# EAGLE design HYPNOS_BOARD_SHIELD_V1 (EAGLE 8.1.1)
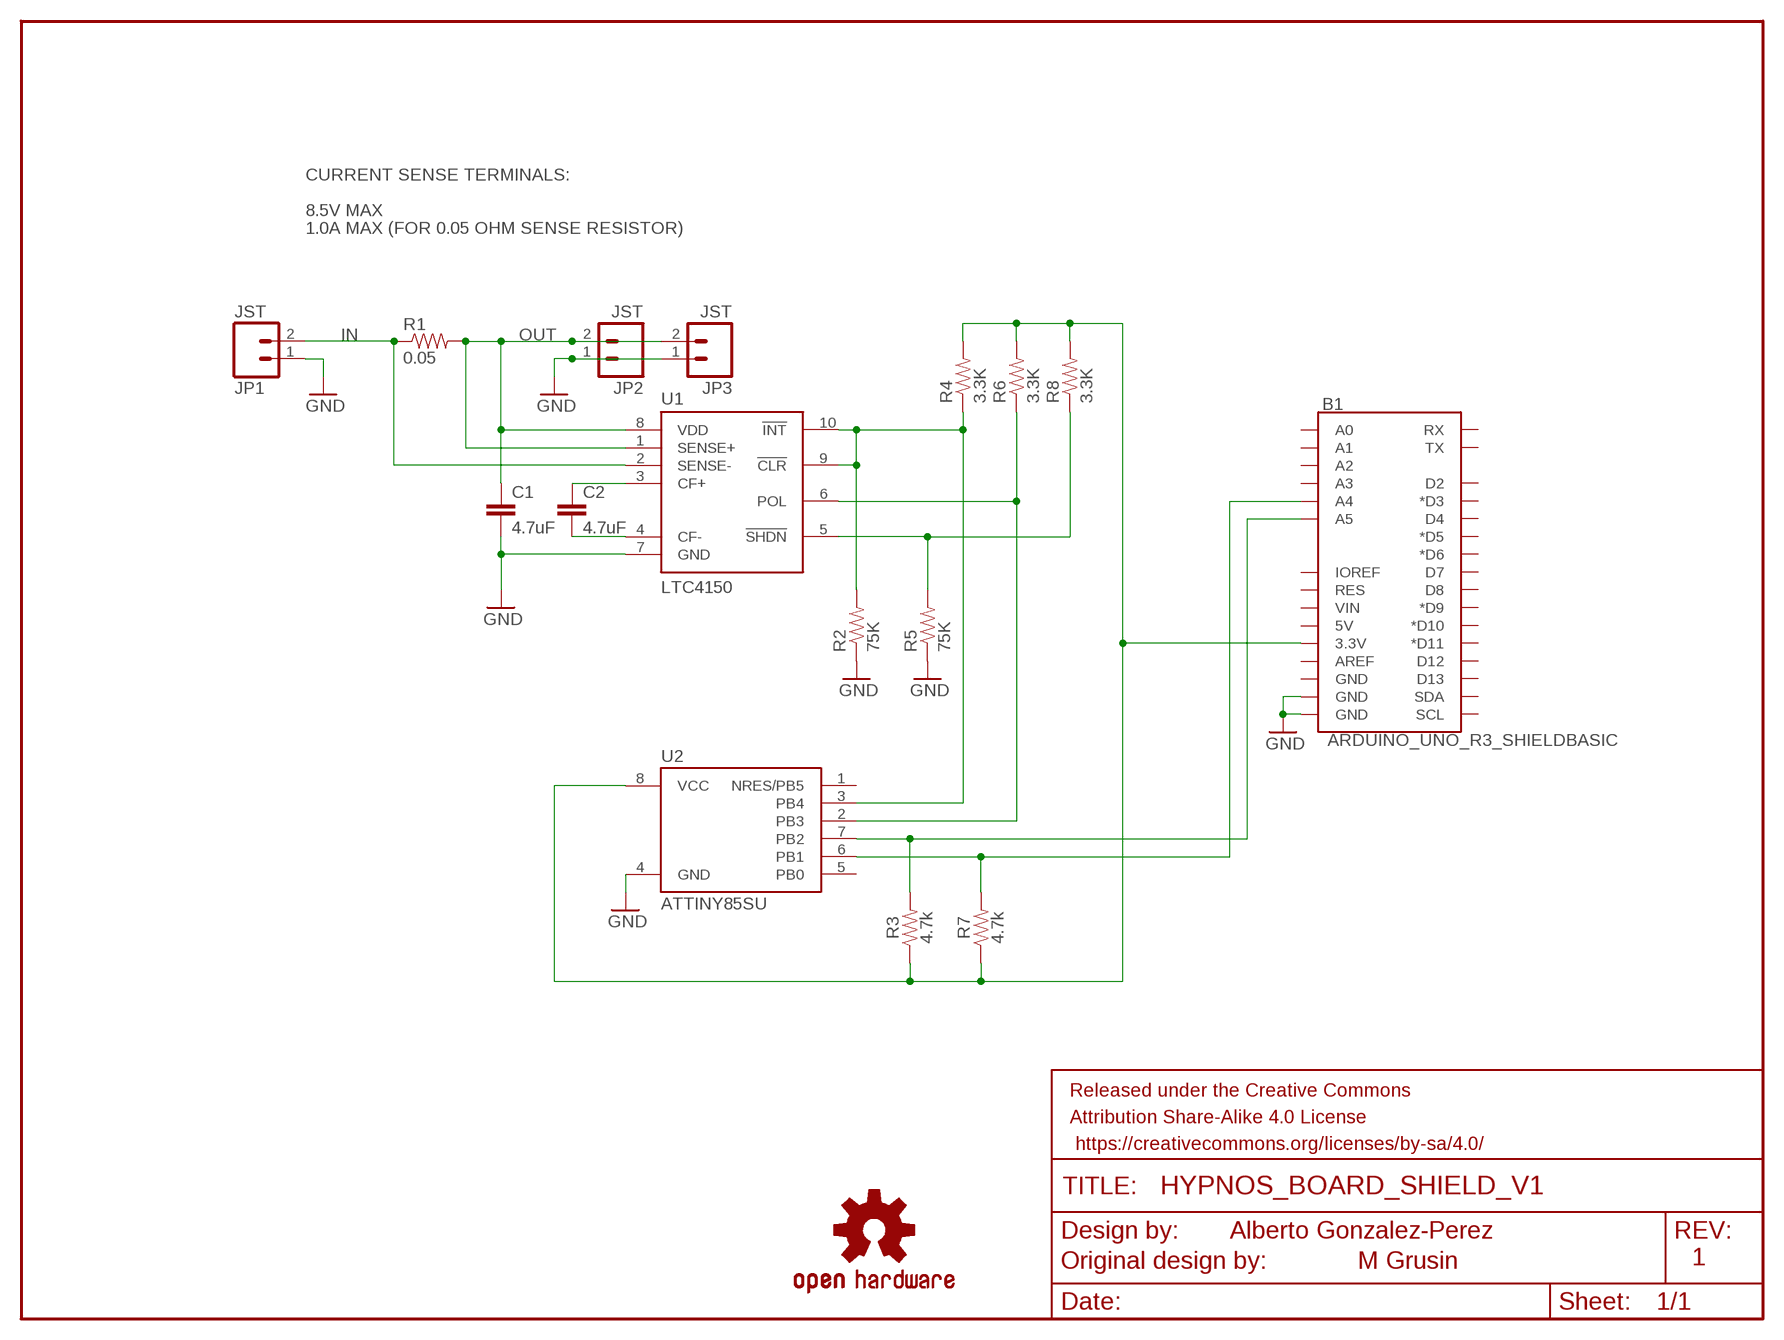
[diagram p0: schematic, sheet 1]

## Parts
B1  ARDUINO_UNO_R3_SHIELDBASIC  [UNO_R3_SHIELD]
C1  4.7uF  CAP0603-CAP  [0603-CAP]
C2  4.7uF  CAP0603-CAP  [0603-CAP]
FRAME1  FRAME-LETTER  [CREATIVE_COMMONS]
JP1  JST  M02-JST-2MM-SMT  [JST-2-SMD]
JP2  JST  M02-JST-2MM-SMT  [JST-2-SMD]
JP3  JST  M02-JST-2MM-SMT  [JST-2-SMD]
LOGO1  OSHW-LOGOS  [OSHW-LOGO-S]
R1  0.05  RESISTOR1206  [1206]
R2  75K  RESISTOR0603-RES  [0603-RES]
R3  4.7k  4.7KOHM-0603-1/10W-1%  [0603]
R4  3.3K  RESISTOR0603-RES  [0603-RES]
R5  75K  RESISTOR0603-RES  [0603-RES]
R6  3.3K  RESISTOR0603-RES  [0603-RES]
R7  4.7k  4.7KOHM-0603-1/10W-1%  [0603]
R8  3.3K  RESISTOR0603-RES  [0603-RES]
U1  LTC4150  [MSOP10]
U2  ATTINY85SU  [ATTINY85]

## Nets
3V3: B1.3.3V R3.1 R4.2 R6.2 R7.1 R8.2 U2.8(VCC)
!INT!: R2.2 R4.1 U1.9(!CLR!) U1.10(!INT!) U2.3(PB4)
!SHDN!: R5.2 R8.1 U1.5(!SHDN!)
GND: B1.GND@0(GND) B1.GND@1(GND) C1.2 JP1.1 JP2.1 JP3.1 R2.1 R5.1 U1.7(GND) U2.4(GND)
IN: JP1.2 R1.1 U1.2(SENSE-)
N$1: B1.A5 R3.2 U2.7(PB2)
N$3: C2.1 U1.3(CF+)
N$4: C2.2 U1.4(CF-)
OUT: C1.1 JP2.2 JP3.2 R1.2 U1.1(SENSE+) U1.8(VDD)
POL: R6.1 U1.6(POL) U2.2(PB3)
SDA: B1.A4 R7.2 U2.6(PB1)
Unconnected: B1.5V B1.A0 B1.A1 B1.A2 B1.A3 B1.AREF B1.D2 B1.D3(*D3) B1.D4 B1.D5(*D5) B1.D6(*D6) B1.D7 B1.D8 B1.D9(*D9) B1.D10(*D10) B1.D11(*D11) B1.D12 B1.D13 B1.GND@2(GND) B1.IOREF B1.RES B1.RX B1.SCL B1.SDA B1.TX B1.VIN U2.1(NRES/PB5) U2.5(PB0)

## Notes on the sheet
- CURRENT SENSE TERMINALS:
- 8.5V MAX
- 1.0A MAX (FOR 0.05 OHM SENSE RESISTOR)
- Alberto Gonzalez-Perez
- Original design by: | M Grusin | 1

## Library data of the parts
B1 = SparkFun-Boards:ARDUINO_UNO_R3_SHIELD: Arduino R3 Shield Footprint Shield form compatible with the Arduino Uno R3. SparkFun Products: MG2639 Cellular Shield <https://www.sparkfun.com/products/13120> MIDI Shield <https://www.sparkfun.com/products/12898> R3 Stackable Headers Kit <https://www.sparkfun.com/products/11417>
C1 C2 = SparkFun-Passives:CAP: Capacitor Standard 0603 ceramic capacitor, and 0.1" leaded capacitor.
FRAME1 = SparkFun-Aesthetics:FRAME-LETTER: Schematic Frame Standard 8.5x11 US Letter frame
JP1-JP3 = SparkFun-Connectors:M02: Standard 2-pin 0.1" header. Use with - straight break away headers ( PRT-00116) - right angle break away headers (PRT-00553) - swiss pins (PRT-00743) - machine pins (PRT-00117) - female headers (PRT-00115) Molex polarized connector foot print use with: PRT-08233 with associated crimp pins and housings. 2.54_SCREWTERM for use with PRT-10571. 3.5mm Screw Terminal footprints for PRT-08084 5mm Screw Terminal footprints for use with PRT-08433; PROD_ID: CONN-08352
LOGO1 = SparkFun-Aesthetics:OSHW-LOGO: Open Source Hardware Logo This logo indicates the piece of hardware it is found on incorporates a OSHW license and/or adheres to the definition of open source hardware found here: http://freedomdefined.org/OSHW
R1 R2 R4-R6 R8 = SparkFun-Passives:RESISTOR: Resistor Basic schematic elements and footprints for 0603, 1206, and PTH resistors.
R3 R7 = SparkFun-Resistors:4.7KOHM: 4.7kΩ resistor A resistor is a passive two-terminal electrical component that implements electrical resistance as a circuit element. Resistors act to reduce current flow, and, at the same time, act to lower voltage levels within circuits. - Wikipedia; PROD_ID: RES-07857
U1 = mike-temp:LTC4150
U2 = attiny85:ATTINY85: ATMEL ATtiny 85

## Board
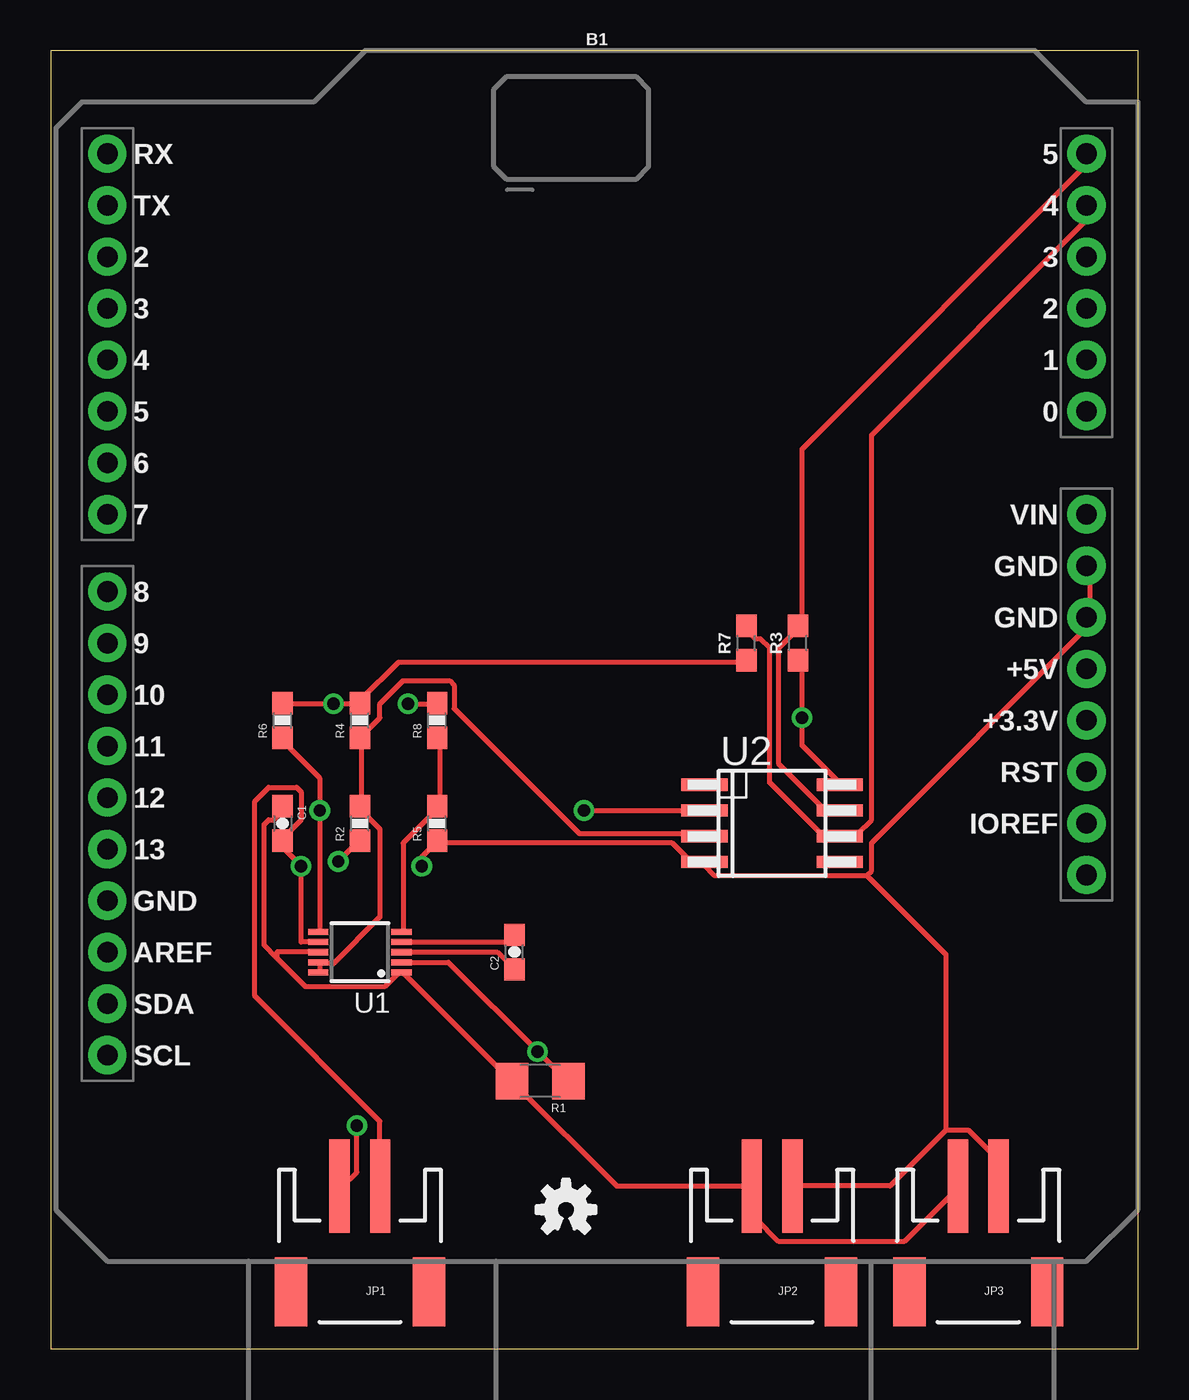
[diagram p1: board, top side]
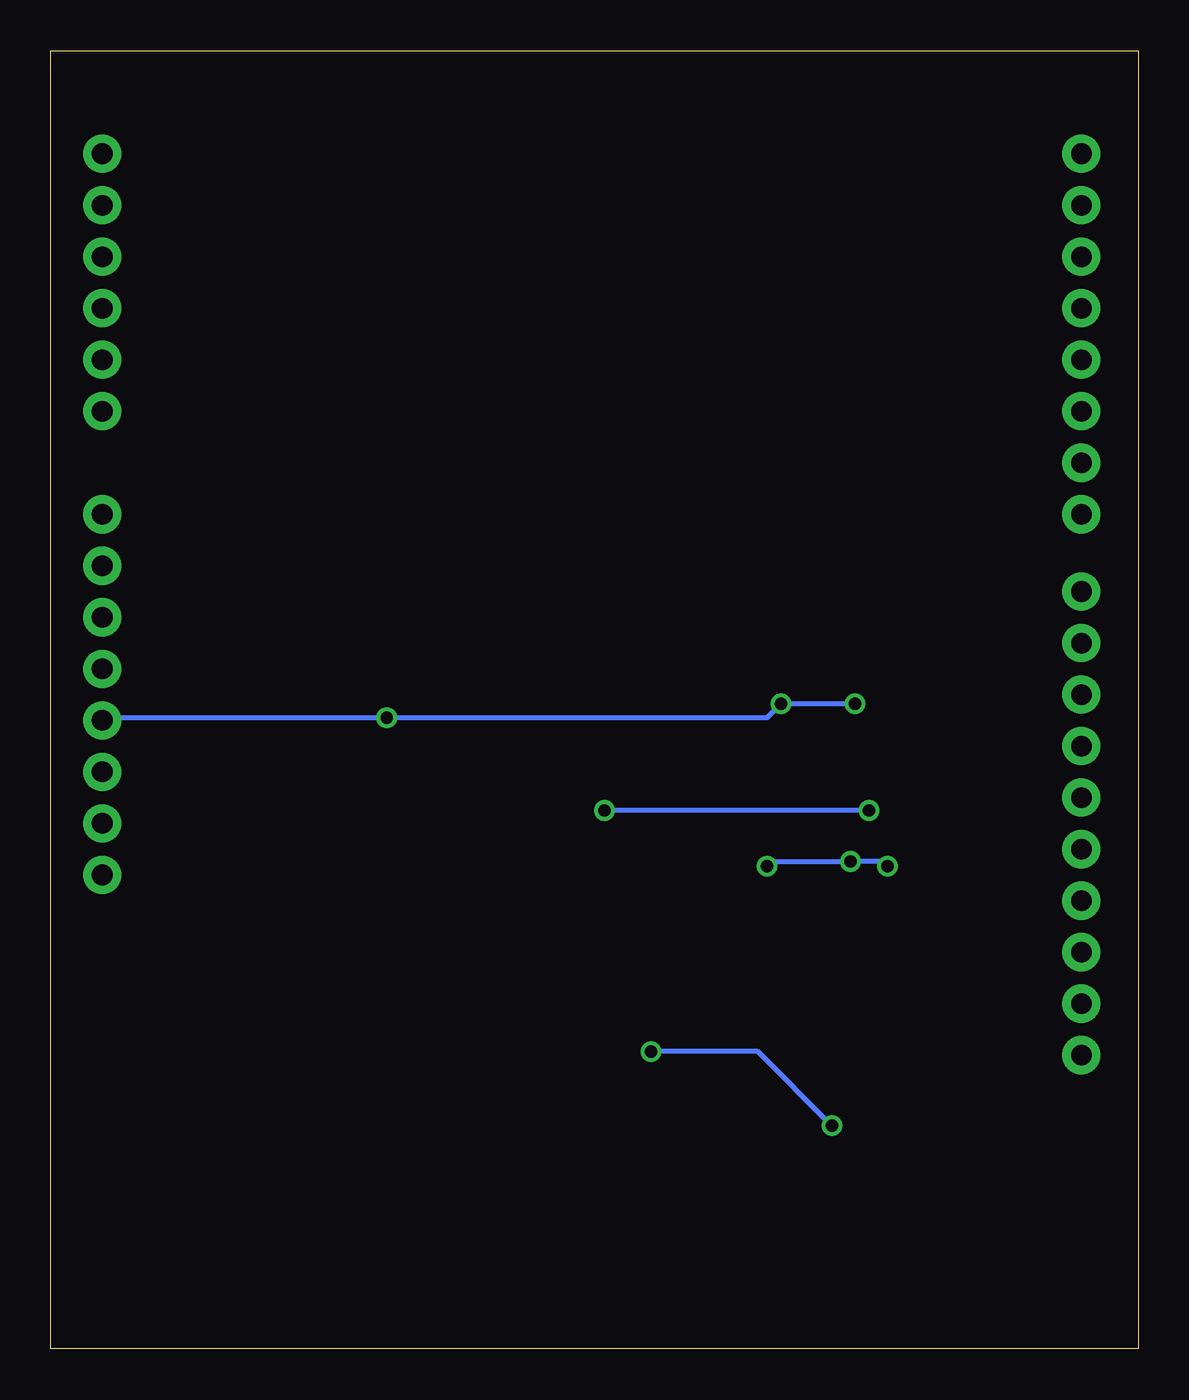
[diagram p2: board, bottom side, seen from below]

Size 53.59 x 64.01 mm. Coordinates in mm from the lower left corner, seen from the top.
Outline: 0,0 53.59,0 53.59,64.01 0,64.01 0,0
Copper layers (1*16): Top 0.035mm / dielectric 1.5mm / Bottom 0.035mm
Design rules "default": minimum track width 10mil, minimum drill 24mil, track to track 8mil, track to pad 8mil, pad to pad 8mil, via to via 8mil, smd to smd 8mil, copper to edge 40mil, drill to drill 8mil, minimum pad ring 10mil, minimum via ring 8mil, stop-mask expansion 4mil, vias tented up to drill 0mil, thermal gap 10mil

### Footprints (pad centres in the part's own frame; a part is rotated, then mirrored left to right if it is on the bottom)
UNO_R3_SHIELD = drill 1.016 pad 1.88: 3.3V 24.13,-2.54; 5V 24.13,0; A0 24.13,12.7; A1 24.13,15.24; A2 24.13,17.78; A3 24.13,20.32; A4 24.13,22.86; A5 24.13,25.4; AREF -24.13,-13.97; D2 -24.13,20.32; D3 -24.13,17.78; D4 -24.13,15.24; D5 -24.13,12.7; D6 -24.13,10.16; D7 -24.13,7.62; D8 -24.13,3.81; D9 -24.13,1.27; D10 -24.13,-1.27; D11 -24.13,-3.81; D12 -24.13,-6.35; D13 -24.13,-8.89; GND@0 24.13,2.54; GND@1 24.13,5.08; GND@2 -24.13,-11.43; IOREF 24.13,-7.62; NC 24.13,-10.16; RES 24.13,-5.08; RX -24.13,25.4; SCL -24.13,-19.05; SDA -24.13,-16.51; TX -24.13,22.86; VIN 24.13,7.62
0603-CAP = smd 1.1 x 1: 1 -0.85,0; 2 0.85,0
JST-2-SMD = smd 1 x 4.6: 1 -1,-3.7; 2 1,-3.7 | smd 1.6 x 3.4: NC1 -3.4,1.5; NC2 3.4,1.5
1206 = smd 1.6 x 1.8: 1 -1.4,0; 2 1.4,0
0603-RES = smd 1.1 x 1: 1 -0.85,0; 2 0.85,0
0603 = smd 1.1 x 1: 1 -0.85,0; 2 0.85,0
MSOP10 = smd 0.3 x 1: 1 -1,-2.05; 2 -0.5,-2.05; 3 0,-2.05; 4 0.5,-2.05; 5 1,-2.05; 6 1,2.05; 7 0.5,2.05; 8 0,2.05; 9 -0.5,2.05; 10 -1,2.05
ATTINY85 = smd 0.6 x 2.286: 1 -1.905,-3.33; 2 -0.635,-3.33; 3 0.635,-3.33; 4 1.905,-3.33; 5 1.905,3.33; 6 0.635,3.33; 7 -0.635,3.33; 8 -1.905,3.33

### Placement (x,y rotation side)
B1  26.92,33.53 0 top
C1  11.43,25.91 270 top
C2  22.86,19.56 90 top
FRAME1  8.89,-31.24 0 top  (outside the outline)
JP1  15.24,4.32 180 top
JP2  35.56,4.32 180 top
JP3  45.72,4.32 180 top
LOGO1  25.4,6.86 0 top
R1  24.13,13.21 180 top
R2  15.24,25.91 90 top
R3  36.83,34.8 90 top
R4  15.24,30.99 90 top
R5  19.05,25.91 90 top
R6  11.43,30.99 90 top
R7  34.29,34.8 90 top
R8  19.05,30.99 90 top
U1  15.24,19.56 90 top
U2  35.56,25.91 270 top

### Tracks (layer width: path | path; a pad name or v marks a point on that pad's centre or on a via)
3V3  (via drill 0.61)
  Top 0.254: R3.1 37.03,33.86 v37.03,31.12 37.03,29.74 38.86,27.91 U2.8 | R6.2 11.43,31.8 v13.95,31.8 15.09,31.8 R4.2 15.32,32.03 17.15,33.86 34.29,33.86 R7.1 | v17.6,31.8 18.97,31.8 R8.2
  Bottom 0.254: v13.95,31.8 v17.6,31.8 18.29,31.12 v37.03,31.12 50.98,31.12 B1.3.3V
!INT!
  Top 0.254: 13.26,19 13.26,18.54 U1.10 | 13.26,19 13.95,19 16.23,21.29 16.23,25.63 15.32,26.54 R2.2 15.32,26.77 15.32,29.97 R4.1 15.32,30.2 16.23,31.12 16.23,31.8 17.37,32.94 19.66,32.94 19.89,32.71 19.89,31.57 26.06,25.4 32,25.4 U2.3 | 13.26,19 U1.9
!SHDN!
  Top 0.254: U1.5 17.37,20.6 17.37,24.94 18.97,26.54 R5.2 19.2,26.77 19.2,29.97 R8.1
GND  (via drill 0.61)
  Top 0.254: JP1.1 16.23,11.23 10.06,17.4 10.06,27 10.74,27.69 12.12,27.69 12.34,27.46 12.34,26.09 11.43,25.17 C1.2 11.43,24.71 v12.34,23.8 12.34,20.06 U1.7 | v14.17,24.03 15.09,24.94 R2.1 | 44.12,10.77 41.38,8.03 36.58,8.03 JP2.1 | 44.12,10.77 45.26,10.77 46.63,9.4 46.63,8.03 JP3.1 | B1.GND@1 51.21,38.43 51.21,36.14 B1.GND@0 50.98,35.92 50.98,35.46 40.46,24.94 40.46,23.57 40.23,23.34 | 40.23,23.34 32.69,23.34 32.23,23.8 U2.4 32,24.03 31.55,24.03 30.63,24.94 19.2,24.94 R5.1 18.97,24.94 18.29,24.26 v18.29,23.8 | 44.12,10.77 44.12,19.46 40.23,23.34
  Bottom 0.254: v12.34,23.8 12.57,24.03 v14.17,24.03 18.06,24.03 v18.29,23.8
IN  (via drill 0.61)
  Top 0.254: v15.09,11 15.09,8.71 14.4,8.03 JP1.2 | R1.1 25.38,13.28 v24,14.66 19.6,19.06 U1.2
  Bottom 0.254: v24,14.66 18.74,14.66 v15.09,11
N$1
  Top 0.254: U2.7 38.18,26.54 35.89,28.83 35.89,34.54 36.8,35.46 R3.2 37.03,35.69 37.03,44.37 50.98,58.32 50.98,58.78 B1.A5
N$3
  Top 0.254: U1.3 22.01,19.56 C2.1
N$4
  Top 0.254: U1.4 22.86,20.06 C2.2
OUT
  Top 0.254: JP3.2 44.58,7.8 42.06,5.28 35.89,5.28 34.75,6.43 34.75,7.8 JP2.2 34.52,8.03 27.89,8.03 22.86,13.06 R1.2 22.63,13.28 17.37,18.54 U1.1 17.15,18.54 16.46,17.86 12.57,17.86 11.15,19.28 | 11.15,19.28 10.52,19.91 10.52,25.86 10.74,26.09 10.97,26.09 11.43,26.54 C1.1 | U1.8 11.15,19.56 11.15,19.28
POL  (via drill 0.61)
  Top 0.254: U1.6 13.26,20.6 v13.26,26.54 13.26,28.14 11.43,29.97 R6.1 | v26.29,26.54 U2.2
  Bottom 0.254: v13.26,26.54 v26.29,26.54
SDA
  Top 0.254: R7.2 34.29,35.46 34.75,35 34.98,35 35.43,34.54 35.43,27.91 37.95,25.4 38.86,25.4 U2.6 39.09,25.4 39.78,25.4 40.46,26.09 40.46,45.06 50.98,55.57 50.98,56.26 B1.A4